# Altium schematic sheet OSPLC2_2_IO_Top.SchDoc
size 294 x 198 mm
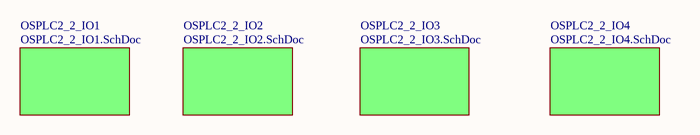
[diagram p0: OSPLC2_2_IO_Top.SchDoc]

## Sub-sheets
OSPLC2_2_IO1 = OSPLC2_2_IO1.SchDoc: no entries
OSPLC2_2_IO2 = OSPLC2_2_IO2.SchDoc: no entries
OSPLC2_2_IO3 = OSPLC2_2_IO3.SchDoc: no entries
OSPLC2_2_IO4 = OSPLC2_2_IO4.SchDoc: no entries